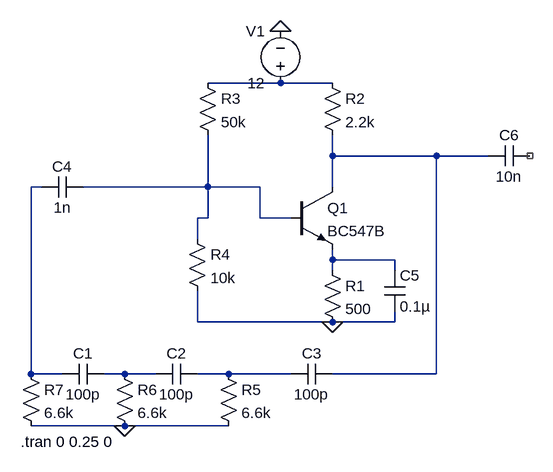
[diagram p0: schematic analogproject.asc]
analogproject.asc, the LTspice schematic file:
Version 4
SHEET 1 880 680
WIRE -112 -224 -224 -224
WIRE -32 -224 -112 -224
WIRE -32 -112 -32 -144
WIRE 128 -112 -32 -112
WIRE 208 -112 128 -112
WIRE -480 -64 -496 -64
WIRE -224 -64 -224 -144
WIRE -224 -64 -416 -64
WIRE -144 -64 -224 -64
WIRE -32 -64 -32 -112
WIRE -224 -16 -224 -64
WIRE -224 -16 -240 -16
WIRE -144 -16 -144 -64
WIRE -96 -16 -144 -16
WIRE -240 16 -240 -16
WIRE -32 48 -32 32
WIRE 64 48 -32 48
WIRE -32 64 -32 48
WIRE 64 64 64 48
WIRE -240 144 -240 96
WIRE -32 144 -240 144
WIRE 64 144 64 128
WIRE 64 144 -32 144
WIRE -496 224 -496 -64
WIRE -448 224 -496 224
WIRE -352 224 -384 224
WIRE -304 224 -352 224
WIRE -192 224 -240 224
WIRE -96 224 -192 224
WIRE 128 224 128 -112
WIRE 128 224 -32 224
WIRE -352 304 -496 304
WIRE -192 304 -352 304
FLAG -32 144 0
FLAG -352 304 0
FLAG -112 -304 0
SYMBOL npn -96 -64 R0
SYMATTR InstName Q1
SYMATTR Value BC547B
SYMBOL res -48 48 R0
SYMATTR InstName R1
SYMATTR Value 500
SYMBOL res -48 -240 R0
SYMATTR InstName R2
SYMATTR Value 2.2k
SYMBOL res -240 -240 R0
SYMATTR InstName R3
SYMATTR Value 50k
SYMBOL res -256 0 R0
SYMATTR InstName R4
SYMATTR Value 10k
SYMBOL res -208 208 R0
SYMATTR InstName R5
SYMATTR Value 6.6k
SYMBOL res -368 208 R0
SYMATTR InstName R6
SYMATTR Value 6.6k
SYMBOL res -512 208 R0
SYMATTR InstName R7
SYMATTR Value 6.6k
SYMBOL cap -384 208 R90
WINDOW 0 0 32 VBottom 2
WINDOW 3 32 32 VTop 2
SYMATTR InstName C1
SYMATTR Value 100p
SYMBOL cap -240 208 R90
WINDOW 0 0 32 VBottom 2
WINDOW 3 32 32 VTop 2
SYMATTR InstName C2
SYMATTR Value 100p
SYMBOL cap -32 208 R90
WINDOW 0 0 32 VBottom 2
WINDOW 3 32 32 VTop 2
SYMATTR InstName C3
SYMATTR Value 100p
SYMBOL cap -416 -80 R90
WINDOW 0 0 32 VBottom 2
WINDOW 3 32 32 VTop 2
SYMATTR InstName C4
SYMATTR Value 1n
SYMBOL cap 48 64 R0
SYMATTR InstName C5
SYMATTR Value 0.1µ
SYMBOL cap 272 -128 R90
WINDOW 0 0 32 VBottom 2
WINDOW 3 32 32 VTop 2
SYMATTR InstName C6
SYMATTR Value 10n
SYMBOL voltage -112 -208 R180
WINDOW 0 24 96 Left 2
WINDOW 3 24 16 Left 2
WINDOW 123 0 0 Left 0
WINDOW 39 0 0 Left 0
SYMATTR InstName V1
SYMATTR Value 12
TEXT -512 328 Left 2 !.tran 0 0.25 0

The netlist it stands for:
* analogproject.asc
Q1 N002 N004 N005 0 BC547B
R1 N005 0 500
R2 N001 N002 2.2k
R3 N001 N004 50k
R4 N004 0 10k
R5 N007 0 6.6k
R6 N006 0 6.6k
R7 N003 0 6.6k
C1 N006 N003 100p
C2 N007 N006 100p
C3 N002 N007 100p
C4 N004 N003 1n
C5 N005 0 0.1µ
C6 NC_01 N002 10n
V1 N001 0 12
.model NPN NPN
.model PNP PNP
.lib standard.bjt
.tran 0 0.25 0
.backanno
.end